# EasyEDA Pro project EPass_2026-04-09_20-28-50.eprj

# Schematic Schematic1
Board Name: Board1
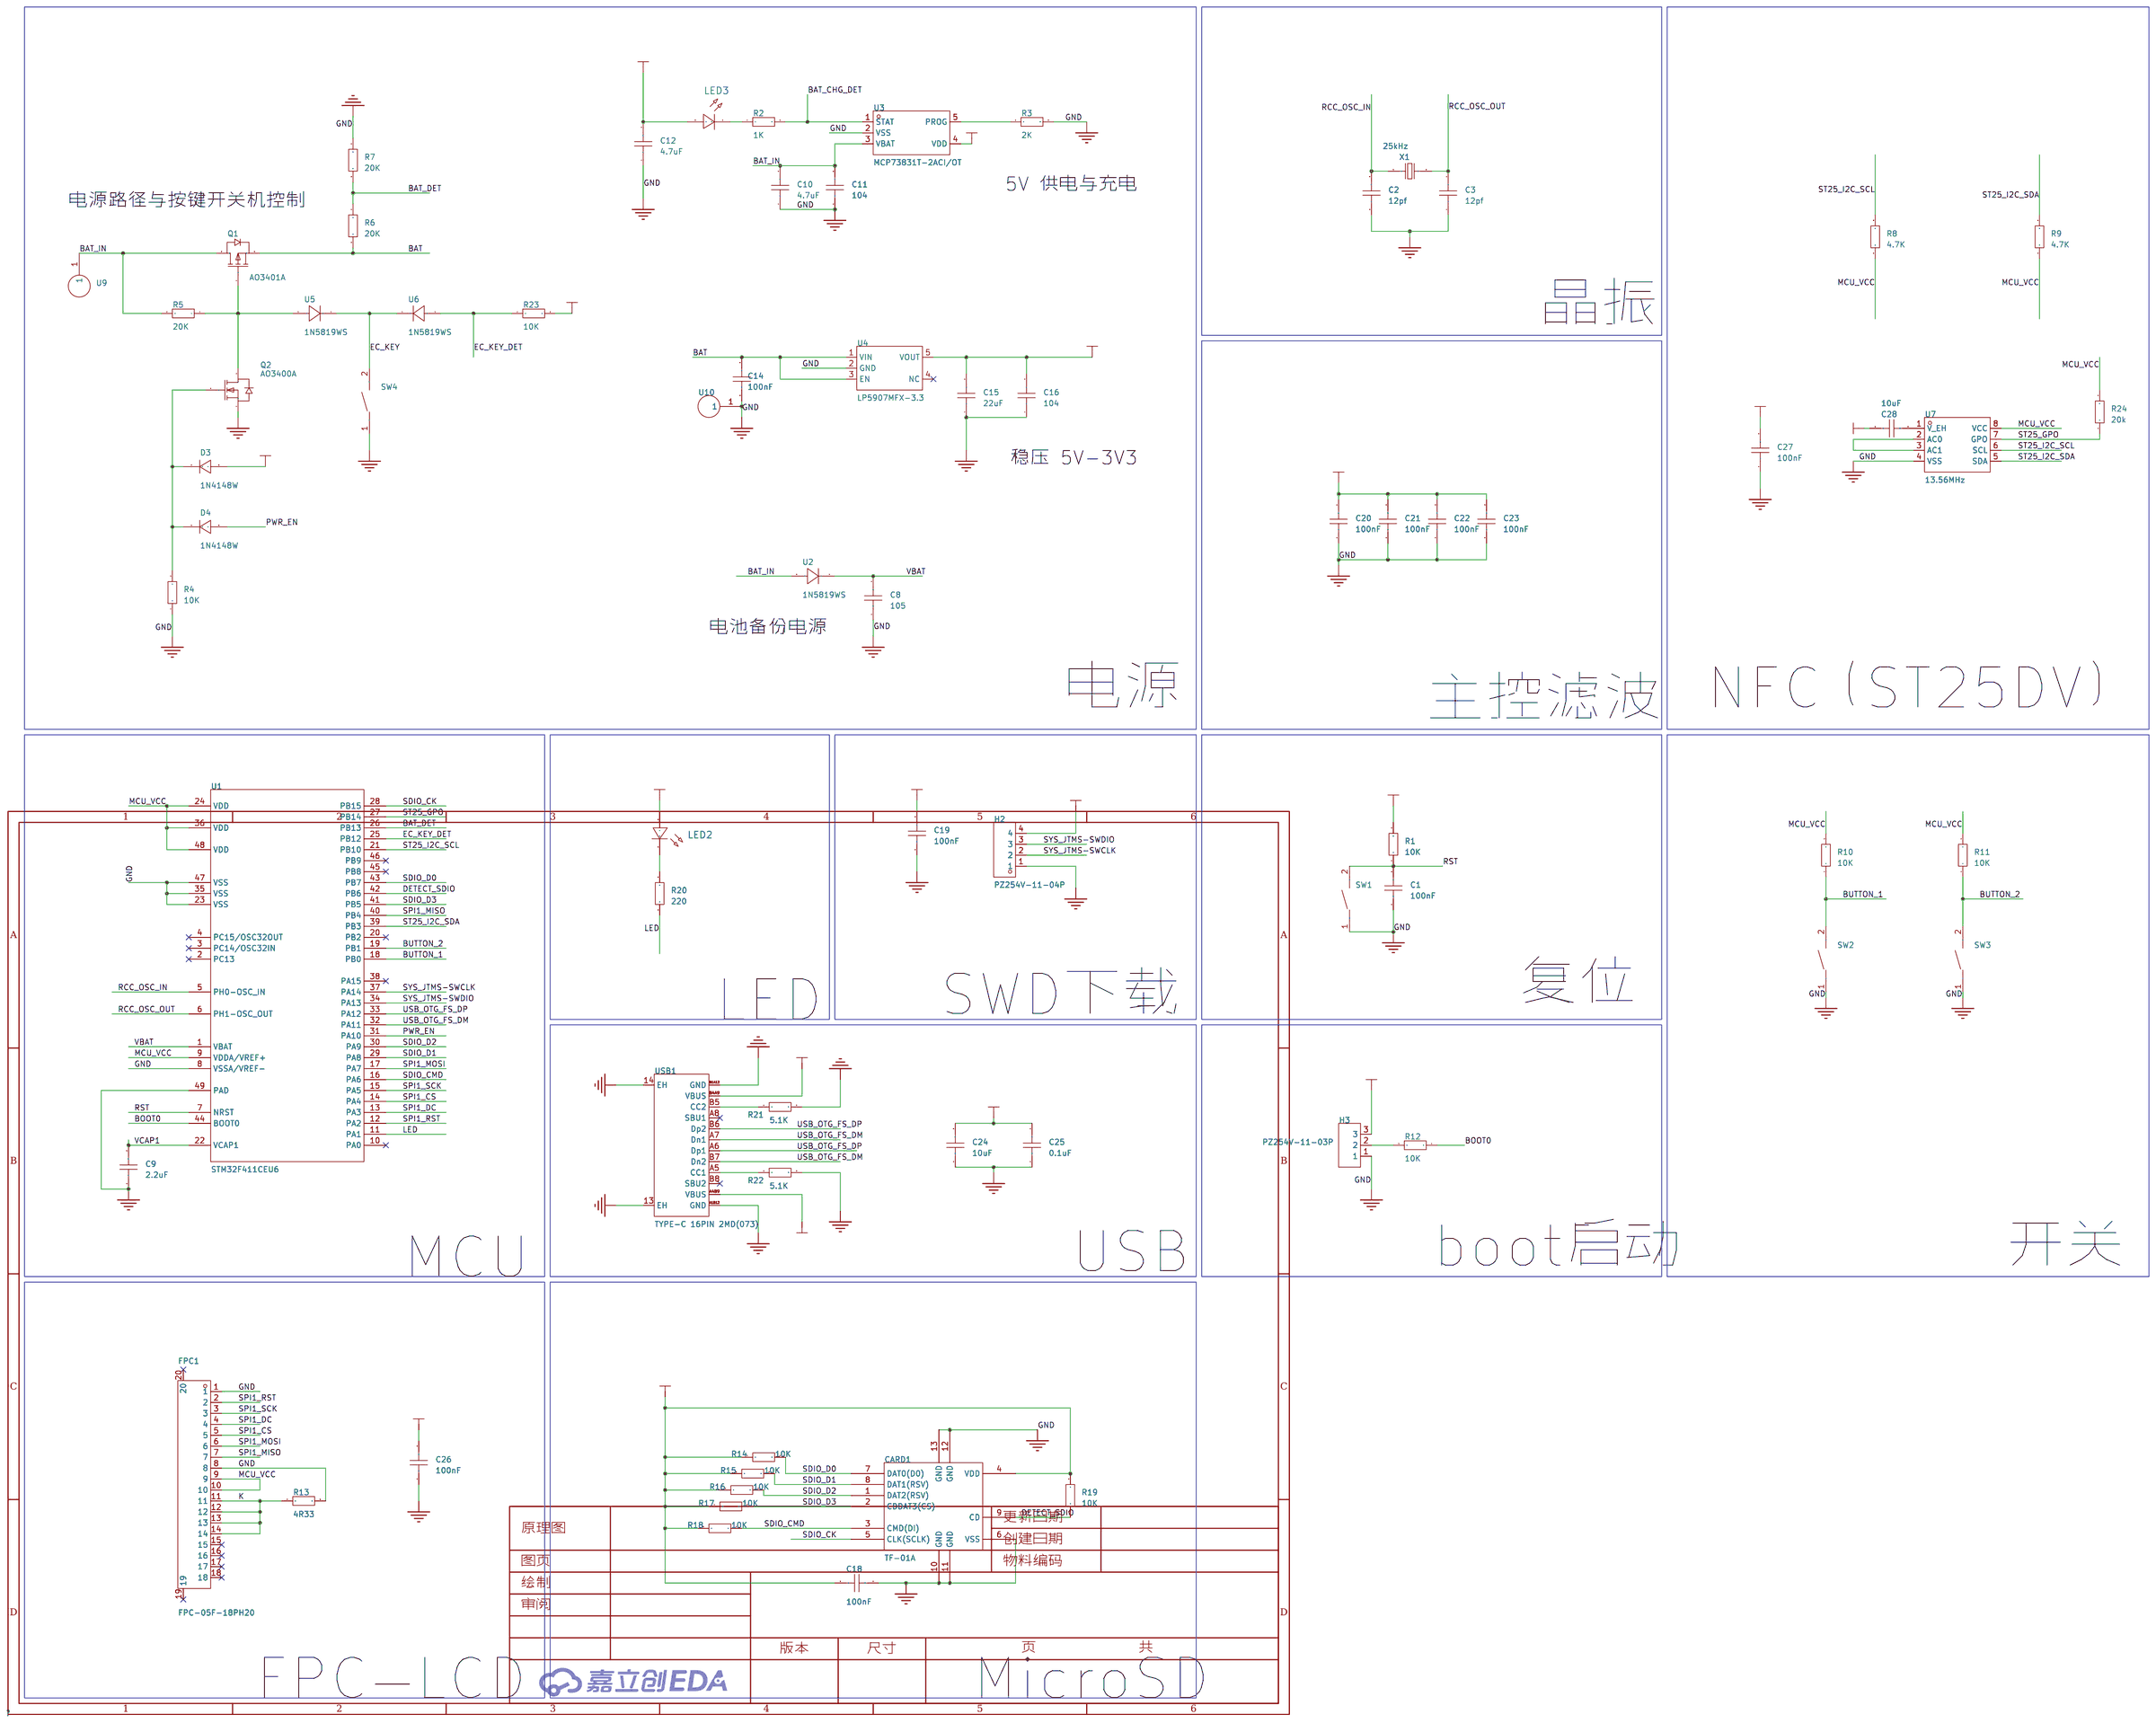
[diagram p0: schematic sheet]

## Parts
C1  100nF  [C0603]
C2  12pf  [C0603]
C3  12pf  [C0603]
C8  105  [C0603]
C9  2.2uF  [C0603]
C10  4.7uF  [C0603]
C11  104  [C0603]
C12  4.7uF  [C0603]
C14  100nF  [C0603]
C15  22uF  [C0603]
C16  104  [C0603]
C18  100nF  [C0603]
C19  100nF  [C0603]
C20  100nF  [C0603]
C21  100nF  [C0603]
C22  100nF  [C0603]
C23  100nF  [C0603]
C24  10uF  [C0603]
C25  0.1uF  [C0603]
C26  100nF  [C0603]
C27  100nF  [C0603]
C28  10uF  [C0603]
CARD1  TF-01A  [TF-SMD_TF-01A]
D3  1N4148W  [SOD-123_L2.7-W1.6-LS3.7-FD]
D4  1N4148W  [SOD-123_L2.7-W1.6-LS3.7-FD]
FPC1  FPC-05F-18PH20  [FPC-SMD_18P-P0.50_FPC-05F-18PH20]
H2  PZ254V-11-04P  [HDR-TH_4P-P2.54-V-M]
H3  PZ254V-11-03P  [HDR-TH_3P-P2.54-V-M_PZ254V-11-03P]
LED2  -  [LED_0603]
LED3  -  [LED_0603]
Q1  AO3401A  [SOT-23_L2.9-W1.3-P1.90-LS2.4-BR]
Q2  AO3400A  [SOT-23-3_L2.9-W1.3-P1.90-LS2.4-BR]
R1  10K  [R0603]
R2  1K  [R0603]
R3  2K  [R0603]
R4  10K  [R0603]
R5  20K  [R0603]
R6  20K  [R0603]
R7  20K  [R0603]
R8  4.7K  [R0603]
R9  4.7K  [R0603]
R10  10K  [R0603]
R11  10K  [R0603]
R12  10K  [R0603]
R13  4R33  [R0603]
R14  10K  [R0603]
R15  10K  [R0603]
R16  10K  [R0603]
R17  10K  [R0603]
R18  10K  [R0603]
R19  10K  [R0603]
R20  220  [R0603]
R21  5.1K  [R0603]
R22  5.1K  [R0603]
R23  10K  [R0603]
R24  20k  [R0603]
SW1  TS-1088-AR02016  [SW-SMD_L3.9-W3.0-P4.45]
SW2  TS-1088-AR02016  [SW-SMD_L3.9-W3.0-P4.45]
SW3  TS-1088-AR02016  [SW-SMD_L3.9-W3.0-P4.45]
SW4  TS-1088-AR02016  [SW-SMD_L3.9-W3.0-P4.45]
U1  STM32F411CEU6  [UFQFPN-48_L7.0-W7.0-P0.50-BL-EP]
U2  1N5819WS  [SOD-323_L1.8-W1.3-LS2.5-RD]
U3  MCP73831T-2ACI/OT  [SOT-23-5_L3.0-W1.7-P0.95-LS2.8-BL]
U4  LP5907MFX-3.3  [SOT-23-5_L3.0-W1.7-P0.95-LS2.8-BR]
U5  1N5819WS  [SOD-323_L1.8-W1.3-LS2.5-RD]
U6  1N5819WS  [SOD-323_L1.8-W1.3-LS2.5-RD]
U7  13.56MHz  [SO-8_L4.9-W3.9-P1.27-LS5.9-BL]
U9  -  [焊盘]
U10  -  [焊盘]
USB1  TYPE-C 16PIN 2MD(073)  [USB-C-SMD_TYPE-C-16PIN-2MD-073]
X1  25kHz  [FC-135R_L3.2-W1.5]

## Library data of the parts
C1-C3 C8-C12 C14-C16 C18-C28 = CAP_0603: Supplier Footprint: 0603
CARD1 = TF-01A_C91145: LCSC Part Name: 自弹式 MicroSD卡(TF卡) 卡座; Supplier Part: C91145; Manufacturer: 韩国韩荣; Supplier Footprint: SMD; JLCPCB Part Class: 扩展库; Datasheet: https://item.szlcsc.com/datasheet/TF-01A/92334.html; Supplier: LCSC; Card Connection Mode: 自弹式; Card Type: MicroSD卡(TF卡); Connector Type: 卡座; Supplementary Features: 带定位柱; Height Above Board: 1.85mm
D3 D4 = 1N4148W_C7420318: LCSC Part Name: 100V 150mA; Supplier Part: C7420318; Manufacturer: R+O(宏嘉诚); Supplier Footprint: SOD-123; JLCPCB Part Class: Extended Part; Datasheet: https://item.szlcsc.com/datasheet/1N4148W/8397140.html; Supplier: LCSC; Diode Configuration: 独立式; Pd - Power Dissipation: 400mW; Current - Rectified: 150mA; Voltage - DC Reverse(Vr): 100V; Voltage - Forward(Vf@If): 1.25V@150mA; Non-Repetitive Peak Forward Surge Current: 2A; Reverse Leakage Current (Ir): 1uA@75V; Reverse Recovery Time (trr): 4ns; Operating Junction Temperature Range: -55℃~+150℃
FPC1 = FPC-05F-18PH20: LCSC Part Name: 翻盖式 卧贴 P数:18P 间距:0.5mm; Supplier Part: C2856802; Manufacturer: XUNPU(讯普); Supplier Footprint: SMD,P=0.5mm,卧贴; JLCPCB Part Class: 扩展库; Datasheet: https://item.szlcsc.com/datasheet/FPC-05F-18PH20/3056900.html; Supplier: LCSC; Locking Feature: 翻盖式; Contact Type: 卧贴; Number of Contacts: 18P; Pitch: 0.5mm; Mounting Type: 下接; FFC, FCB Thickness: 0.3mm; Height Above Board: 2mm; Contact Material: 磷青铜; Contact Plating: 锡; Operating Temperature: -25℃~+85℃; Rated Voltage (Max): 50V; Current Rating (Max): 500mA
H2 = PZ254V-11-04P: LCSC Part Name: 1x4P 间距:2.54mm 方针 直插; Supplier Part: C2691448; Manufacturer: XFCN(兴飞); Supplier Footprint: 插件,P=2.54mm; JLCPCB Part Class: 扩展库; Datasheet: https://item.szlcsc.com/datasheet/PZ254V-11-04P/2801085.html; Supplier: LCSC; Pin Structure: 1x4P; Pitch: 2.54mm; Circluar Pins/Square Pins: 方针; Mounting Type: 直插; Number of Rows: 单排; Number of Pins: 4P; Current Rating: 3A; Voltage Rating (Max): 250V; Length of Mating Pin: 6mm; Insulation Height: 2.5mm; Length of End Connection Pin: 3mm; Operating Temperature: -40℃~+105℃; Color: 黑色
H3 = PZ254V-11-03P: LCSC Part Name: 1x3P 间距:2.54mm 方针 直插; Supplier Part: C2937625; Manufacturer: XFCN(兴飞); Supplier Footprint: 插件,P=2.54mm; JLCPCB Part Class: 扩展库; Datasheet: https://item.szlcsc.com/datasheet/PZ254V-11-03P/3293280.html; Supplier: LCSC; Pin Structure: 1x3P; Pitch: 2.54mm; Circluar Pins/Square Pins: 方针; Mounting Type: 直插; Number of Rows: 单排; Number of Pins: 3P; Current Rating: 3A; Voltage Rating (Max): 250V; Length of Mating Pin: 6mm; Insulation Height: 2.5mm; Length of End Connection Pin: 3mm; Operating Temperature: -40℃~+105℃; Color: 黑色
LED2 LED3 = LED_0603-R: Supplier Footprint: 0603
Q1 = AO3401A_C15127: LCSC Part Name: 1个P沟道 耐压:30V 电流:4A; Supplier Part: C15127; Manufacturer: AOS; Supplier Footprint: SOT-23; JLCPCB Part Class: 基础库; Datasheet: https://item.szlcsc.com/datasheet/AO3401A/15801.html; Supplier: LCSC; Number: 1个P沟道; Drain to Source Voltage: 30V; Current - Continuous Drain(Id): 4A; RDS(on): 47mΩ@10V；85mΩ@2.5V；60mΩ@4.5V; Gate Threshold Voltage (Vgs(th)): 900mV; Gate Charge(Qg): 14nC@10V; Input Capacitance(Ciss): 645pF; Reverse Transfer Capacitance (Crss@Vds): 55pF; Output Capacitance(Coss): 80pF
Q2 = AO3400A_C20917: LCSC Part Name: 1个N沟道 耐压:30V 电流:5.7A; Supplier Part: C20917; Manufacturer: AOS; Supplier Footprint: SOT-23-3L; JLCPCB Part Class: 基础库; Datasheet: https://item.szlcsc.com/datasheet/AO3400A/21629.html; Supplier: LCSC; Drain to Source Voltage: 30V; RDS(on): 48mΩ@2.5V; Gate Threshold Voltage (Vgs(th)): 1.45V@250uA; Gate Charge(Qg): 7nC@10V; Input Capacitance(Ciss): 630pF@15V; Operating Temperature: -55℃~+150℃@(Tj); Type: N沟道
R1-R24 = Res_0603: Supplier Footprint: 0603
SW1-SW4 = TS-1088-AR02016: LCSC Part Name: 4*3*2mm 立贴 轻触开关; Supplier Part: C720477; Manufacturer: XUNPU(讯普); Supplier Footprint: SMD,4x3mm; JLCPCB Part Class: 基础库; Datasheet: https://item.szlcsc.com/datasheet/TS-1088-AR02016/763484.html; Supplier: LCSC; Circuit: 单刀单掷; Actuator Style: 圆形按钮; Operating Force: 1.6N; Mounting Type: 立贴; Length: 4mm; Width: 3mm; Switch Height: 2mm; with Bracket: 不带支架; Contact Current: 50mA; Voltage Rating: 12V; Actuator/Cap Color: 黑色; Termination Style: SMD接片; Life: 10万次; Operating Temperature: -30℃~+80℃
U1 = STM32F411CEU6: LCSC Part Name: 带DSP和FPU的高性能基本型系列ARM Cortex-M4 MCU，具有512 KB Flash、100 MHz CPU和ART加速器; Supplier Part: C60420; Manufacturer: ST(意法半导体); Supplier Footprint: UFQFPN-48(7x7); JLCPCB Part Class: 扩展库; Datasheet: https://item.szlcsc.com/datasheet/STM32F411CEU6/61472.html; Supplier: LCSC; CPU Core: ARM-M4; CPU Maximum Speed: 100MHz; Program Storage Size: 512KB; Program Memory Type: FLASH; Number of I/O: 36; ADC (Bit): 12bit; Voltage - Supply: 1.7V~3.6V
U2 U5 U6 = 1N5819WS_C191023: LCSC Part Name: 电压:40V 电流:1A; Supplier Part: C191023; Manufacturer: Hottech(合科泰); Supplier Footprint: SOD-323; JLCPCB Part Class: Basic Part; Datasheet: https://item.szlcsc.com/datasheet/1N5819WS/213850.html; Supplier: LCSC; Voltage - Forward(Vf@If): 600mV@1A; Voltage - DC Reverse(Vr): 40V; Current - Rectified: 1A; Non-Repetitive Peak Forward Surge Current: 25A; Reverse Leakage Current (Ir): 500uA@40V
U3 = MCP73831T-2ACI/OT: LCSC Part Name: 单节锂离子/锂聚合物充电管理控制器; Supplier Part: C424093; Manufacturer: MICROCHIP(美国微芯); Supplier Footprint: SOT-23-5; JLCPCB Part Class: 扩展库; Datasheet: https://item.szlcsc.com/datasheet/MCP73831T-2ACI%252FOT/417116.html; Supplier: LCSC; The Chip Type: 充电芯片; Voltage - Supply: 3.75V~6V; Charge Current - Max: 550mA; Charging Saturation Voltage: 4.2V; Type of Battery: 锂电池; Number of Cells: 1; Operating Temperature: -40℃~+85℃; Battery Temperature Detection: 不支持; Supply Current (Iq): 53uA
U4 = LP5907MFX-3.3: LCSC Part Name: 集成电路; Supplier Part: C23380874; Manufacturer: TECH PUBLIC(台舟); Supplier Footprint: SOT-23-5; JLCPCB Part Class: 扩展库; Datasheet: https://item.szlcsc.com/datasheet/LP5907MFX-3.3/25111544.html; Supplier: LCSC; Output Type: 固定; Voltage - Supply: 5.5V; Output Voltage: 3.3V; Output Current: 300mA; Power Supply Rejection Ratio (PSRR): 75dB@(1kHz); Voltage Dropout: 180mV@(300mA); standby current: 2uA; Noise: 51uVrms; Features: 过流保护；带使能；过热保护; Operating Temperature: -40℃~+150℃; Output Configuration: 正极; Number of Outputs: 1
U7 = ST25DV04KC-IE6S3: LCSC Part Name: 动态NFC/RFID标签IC，带EEPROM、快速传输模式和优化I2C接口; Supplier Part: C3304276; Manufacturer: ST(意法半导体); Supplier Footprint: SO-8; JLCPCB Part Class: 扩展库; Datasheet: https://item.szlcsc.com/datasheet/ST25DV04KC-IE6S3/3868865.html; Supplier: LCSC; agreement: ISO 15693,NFC; Interface: I2C; transmission rate: 53Kbit/s; Voltage - Supply: 1.8V~5.5V
U9 U10 = 焊盘
USB1 = TYPE-C 16PIN 2MD(073): LCSC Part Name: Type-C 母 卧贴; Supplier Part: C2765186; Manufacturer: SHOU HAN(首韩); Supplier Footprint: SMD; JLCPCB Part Class: 扩展库; Datasheet: https://item.szlcsc.com/datasheet/TYPE-C%252016PIN%25202MD(073)/2901843.html; Supplier: LCSC; Connector Type: Type-C; Gender: 母; Mounting Type: 卧贴; Number of Contacts: 16P; Number of Ports: 1; Current Rating-Power: 3A; Voltage Rating: 5V; Connect-Disconnect Life: 1万次; Detection color: 黑色; Operating Temperature: -25℃~+85℃
X1 = Q13FC13500004_C32346: LCSC Part Name: 32.768kHz ±20ppm 12.5pF; Supplier Part: C32346; Manufacturer: EPSON(爱普生); Manufacturer Part: Q13FC13500004; Supplier Footprint: SMD3215-2P; JLCPCB Part Class: 基础库; Datasheet: https://item.szlcsc.com/datasheet/Q13FC13500004/33310.html; Supplier: LCSC; Type: 贴片晶振; Normal temperature Frequency Tolerance: ±20ppm; Load Capacitance: 12.5pF; Equivalent Series Resistance(ESR): 70kΩ; Operating Temperature: -40℃~+85℃

## Nets
+5V: C12.2 C24.2 C25.2 D3.2(A) LED3.2(A) U3.4(VDD) USB1.A4B9(VBUS) USB1.B4A9(VBUS)
GND: C1.1 C2.1 C3.1 C8.1 C9.1 C10.1 C11.1 C12.1 C14.1 C15.1 C16.1 C18.2 C19.1 C20.1 C21.1 C22.1 C23.1 C24.1 C25.1 C26.1 C27.1 CARD1.6(VSS) CARD1.10(GND) CARD1.11(GND) CARD1.12(GND) CARD1.13(GND) FPC1.1 FPC1.8 H2.1 H3.1 Q2.2(S) R3.2 R4.1 R7.1 R13.2 R21.2 R22.2 SW1.1 SW2.1 SW3.1 SW4.1 U1.8(VSSA/VREF-) U1.23(VSS) U1.35(VSS) U1.47(VSS) U1.49(PAD) U3.2(VSS) U4.2(GND) U7.4(VSS) U10.1 USB1.13(EH) USB1.14(EH) USB1.A1B12(GND) USB1.B1A12(GND)
VBAT: C8.2 U1.1(VBAT) U2.1(K)
BAT: C14.2 Q1.2(S) R6.2 U4.1(VIN) U4.3(EN)
BAT_CHG_DET: R2.2 U3.1(STAT)
BAT_DET: R6.1 R7.2 U1.26(PB13)
BAT_IN: C10.2 C11.2 Q1.3(D) R5.2 U2.2(A) U3.3(VBAT) U9.1
BOOT0: R12.1 U1.44(BOOT0)
BUTTON_1: R10.1 SW2.2 U1.18(PB0)
BUTTON_2: R11.1 SW3.2 U1.19(PB1)
DETECT_SDIO: CARD1.9(CD) R19.1 U1.42(PB6)
EC_KEY: SW4.2 U5.1(K) U6.1(K)
EC_KEY_DET: R23.1 U1.25(PB12) U6.2(A)
K: FPC1.11 FPC1.12 FPC1.13 FPC1.14 R13.1
LED: R20.1 U1.11(PA1)
MCU_VCC: C15.2 C16.2 C18.1 C19.2 C20.2 C21.2 C22.2 C23.2 C26.2 C27.2 C28.2 CARD1.4(VDD) FPC1.9 FPC1.10 H2.4 H3.3 LED2.2(A) R1.2 R8.1 R9.1 R10.2 R11.2 R14.1 R15.1 R16.1 R17.1 R18.1 R19.2 R23.2 R24.2 U1.9(VDDA/VREF+) U1.24(VDD) U1.36(VDD) U1.48(VDD) U4.5(VOUT) U7.8(VCC)
PWR_EN: D4.2(A) U1.31(PA10)
RCC_OSC_IN: C2.2 U1.5(PH0-OSC_IN) X1.1
RCC_OSC_OUT: C3.2 U1.6(PH1-OSC_OUT) X1.2
RST: C1.2 R1.1 SW1.2 U1.7(NRST)
SDIO_CK: CARD1.5(CLK(SCLK)) U1.28(PB15)
SDIO_CMD: CARD1.3(CMD(DI)) R18.2 U1.16(PA6)
SDIO_D0: CARD1.7(DAT0(D0)) R14.2 U1.43(PB7)
SDIO_D1: CARD1.8(DAT1(RSV)) R15.2 U1.29(PA8)
SDIO_D2: CARD1.1(DAT2(RSV)) R16.2 U1.30(PA9)
SDIO_D3: CARD1.2(CDDAT3(CS)) R17.2 U1.41(PB5)
SPI1_CS: FPC1.5 U1.14(PA4)
SPI1_DC: FPC1.4 U1.13(PA3)
SPI1_MISO: FPC1.7 U1.40(PB4)
SPI1_MOSI: FPC1.6 U1.17(PA7)
SPI1_RST: FPC1.2 U1.12(PA2)
SPI1_SCK: FPC1.3 U1.15(PA5)
ST25_GPO: R24.1 U1.27(PB14) U7.7(GPO)
ST25_I2C_SCL: R8.2 U1.21(PB10) U7.6(SCL)
ST25_I2C_SDA: R9.2 U1.39(PB3) U7.5(SDA)
SYS_JTMS-SWCLK: H2.2 U1.37(PA14)
SYS_JTMS-SWDIO: H2.3 U1.34(PA13)
USB_OTG_FS_DM: U1.32(PA11) USB1.A7(Dn1) USB1.B7(Dn2)
USB_OTG_FS_DP: U1.33(PA12) USB1.A6(Dp1) USB1.B6(Dp2)
VCAP1: C9.2 U1.22(VCAP1)
$1N3013: LED3.1(C) R2.1
$1N3017: R3.1 U3.5(PROG)
$1N3940: D3.1(C) D4.1(C) Q2.1(G) R4.2
$1N4134: Q1.1(G) Q2.3(D) R5.1 U5.2(A)
$1N5541: U7.2(AC0) U7.3(AC1)
$1N11724: LED2.1(C) R20.2
$1N12366: R21.1 USB1.B5(CC2)
$1N12483: R22.1 USB1.A5(CC1)
$1N12902: H3.2 R12.2
$1N28171: C28.1 U7.1(V_EH)

Not connected (* = marked no-connect by the designer): FPC1 15* 16* 17* 18* 19* 20*; U1 2(PC13)* 3(PC14/OSC32IN)* 4(PC15/OSC32OUT)* 10(PA0)* 20(PB2)* 38(PA15)* 45(PB8)* 46(PB9)*; U4 4(NC)*; USB1 A8(SBU1)* B8(SBU2)*

## Notes on the sheet
- 5V 供电与充电
- 电源路径与按键开关机控制
- 晶振
- 稳压 5V-3V3
- 电池备份电源
- 电源
- 主控滤波
- NFC（ST25DV）
- 复位
- SWD下载
- LED
- USB
- boot启动
- 开关
- MCU
- FPC—LCD
- MicroSD

# Board PCB1
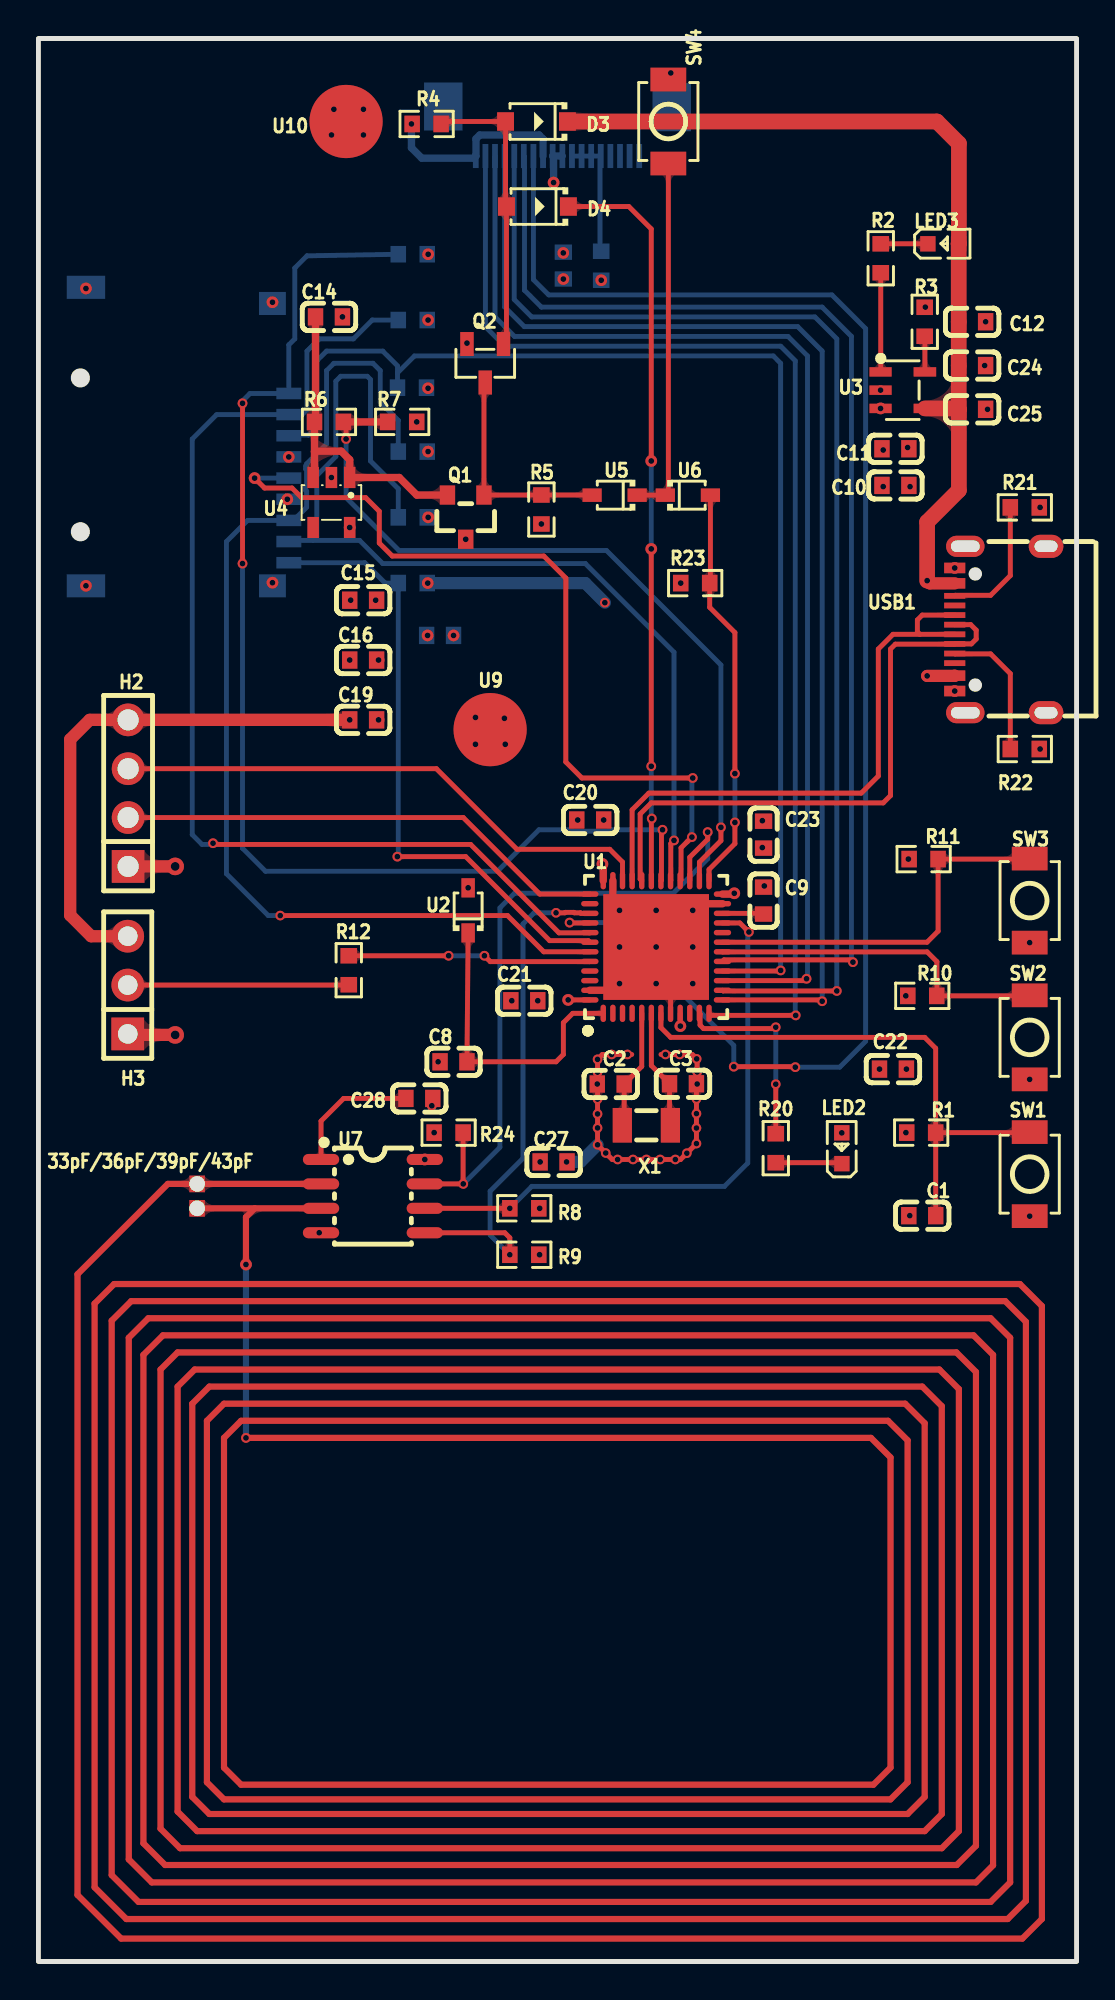
[diagram p1: board, top side]
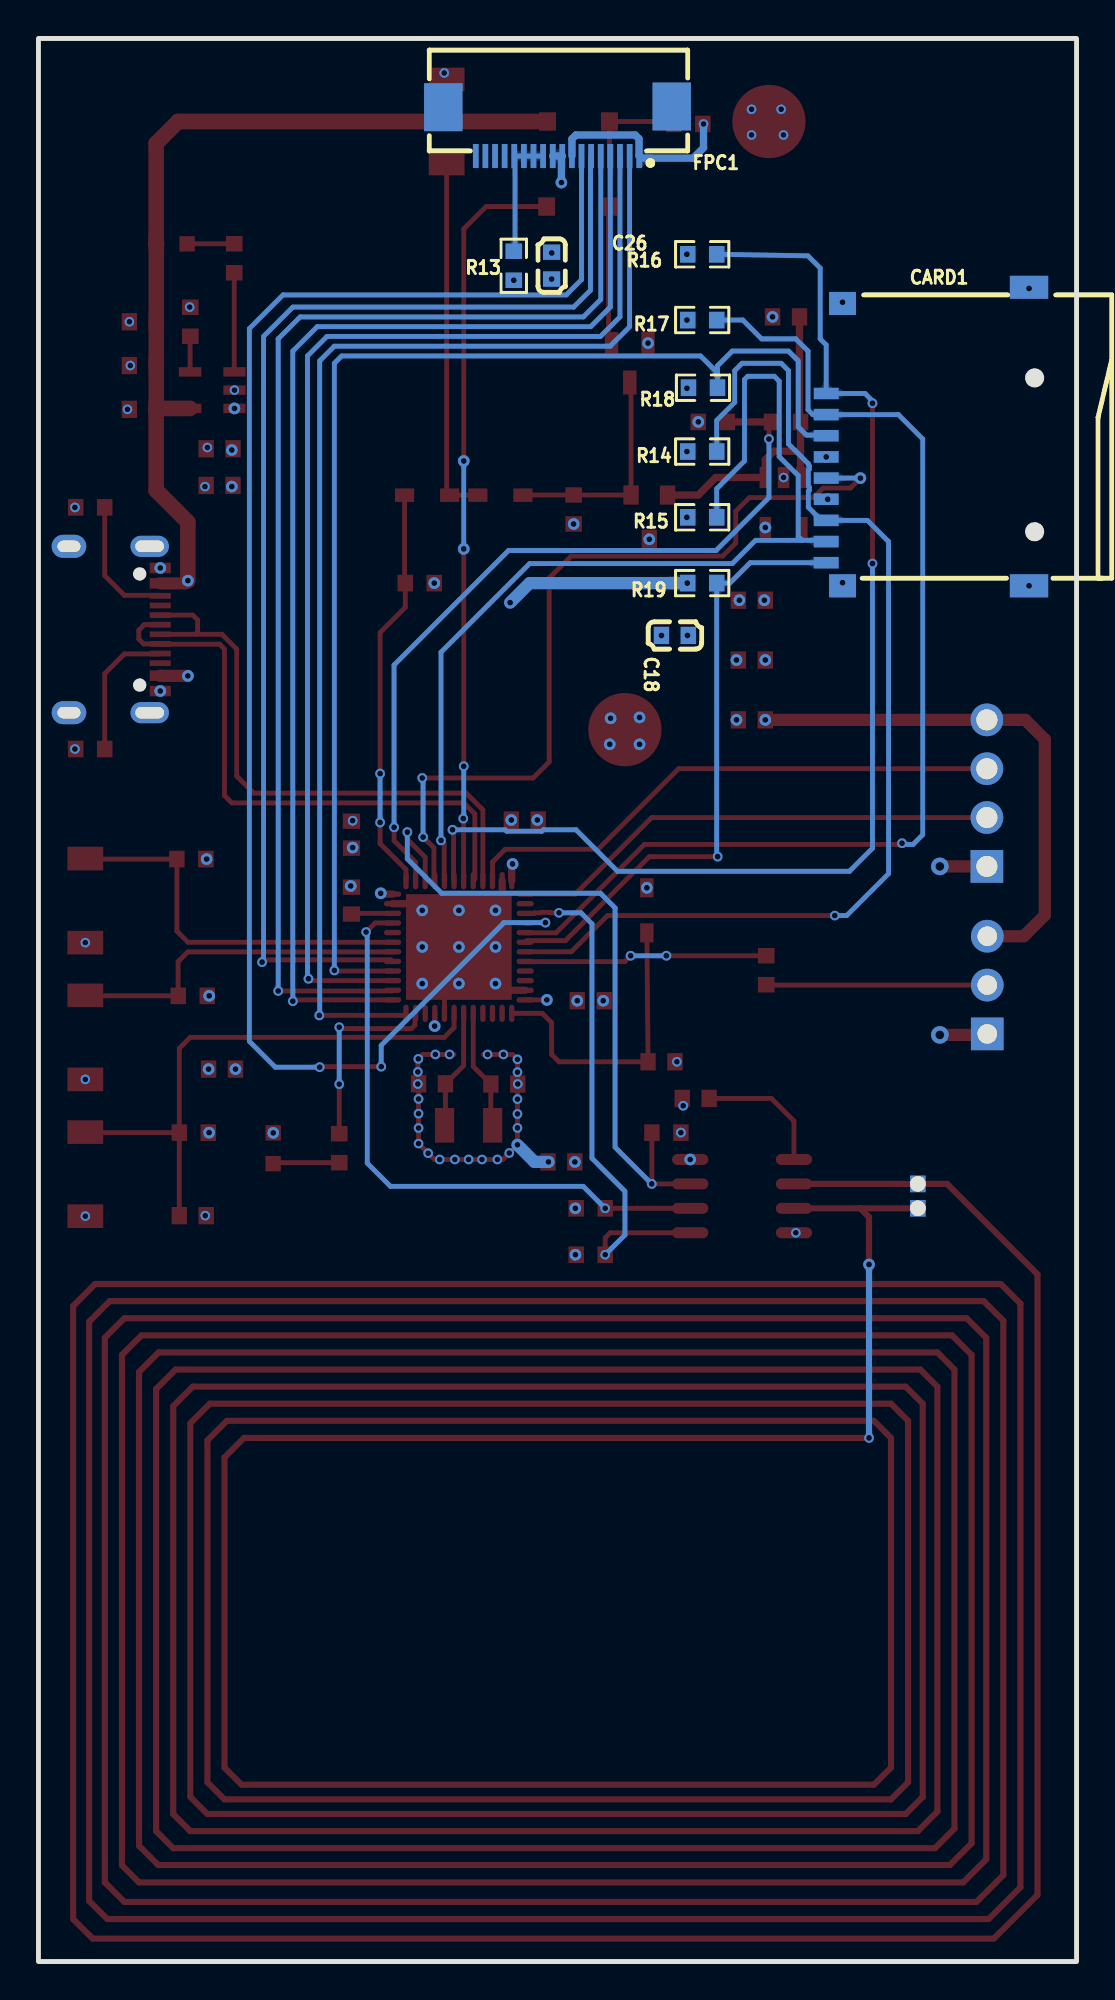
[diagram p2: board, bottom side, seen from below]

Outline 54 x 100 mm; copper layers: Top Layer, POW, GND, Bottom Layer. Coordinates in mm from the lower left corner of the outline.
Outline path: rectangle 0,100 54,0
Stack: Top Layer 0.035mm 外层铜厚1oz / Dielectric1 0.2104mm 7628 RC49% 8.6mil / POW 0.0152mm 内层铜厚 / Dielectric2 1.065mm 1.1mm H/HOZ Copper / GND 0.0152mm 内层铜厚 / Dielectric3 0.2104mm 7628 RC49% 8.6mil / Bottom Layer 0.035mm 外层铜厚1oz

## Design rules (mm)
net RCC_OSC_IN: DP2
net RCC_OSC_OUT: DP2
net USB_OTG_FS_DM: DP1
net USB_OTG_FS_DP: DP1
template: 自定义配置
spacing copperThickness1oz (default): track to track 0.102, other pairs 0.152 to 0.3
spacing copperThickness2oz: track to track 0.203, other pairs 0.152 to 0.3
track width copperThickness1oz (default): min 0.127, default 0.254, max 2.54
track width copperThickness2oz: min 0.203, default 0.254, max 2.54
differential pair differentialPair (default): width min 0.127, default 0.254, max 2.54; gap min 0.152, default 0.152
via viaSize (default): diameter min 0.5, default 0.61, max 10; hole min 0.3, default 0.305, max 6.3

## Placement (name value [footprint] x y rotation side)
C1  100nF  [C0603]  45.97 38.79 0 top
C2  12pf  [C0603]  29.77 45.63 0 top
C3  12pf  [C0603]  33.53 45.64 180 top
C8  105  [C0603]  21.59 46.79 0 top
C9  2.2uF  [C0603]  37.72 55.17 270 top
C10  4.7uF  [C0603]  44.58 76.76 180 top
C11  104  [C0603]  44.58 78.66 180 top
C12  4.7uF  [C0603]  48.57 85.27 180 top
C14  100nF  [C0603]  15.11 85.52 180 top
C15  22uF  [C0603]  16.89 70.79 180 top
C16  104  [C0603]  16.89 67.68 180 top
C18  100nF  [C0603]  20.89 68.96 0 bottom
C19  100nF  [C0603]  16.89 64.57 180 top
C20  100nF  [C0603]  28.7 59.36 0 top
C21  100nF  [C0603]  25.27 49.96 0 top
C22  100nF  [C0603]  44.45 46.41 180 top
C23  100nF  [C0603]  37.72 58.6 270 top
C24  10uF  [C0603]  48.57 82.99 180 top
C25  0.1uF  [C0603]  48.57 80.72 180 top
C26  100nF  [C0603]  27.31 88.19 90 bottom
C27  100nF  [C0603]  26.8 41.58 180 top
C28  10uF  [C0603]  19.81 44.88 0 top
CARD1  TF-01A  [TF-SMD_TF-01A]  7.75 79.3 90 bottom
D3  1N4148W  [SOD-123_L2.7-W1.6-LS3.7-FD]  25.91 95.68 0 top
D4  1N4148W  [SOD-123_L2.7-W1.6-LS3.7-FD]  25.96 91.26 0 top
FPC1  FPC-05F-18PH20  [FPC-SMD_18P-P0.50_FPC-05F-18PH20]  27 95.17 0 bottom
H2  PZ254V-11-04P  [HDR-TH_4P-P2.54-V-M]  4.66 60.76 90 top
H3  PZ254V-11-03P  [HDR-TH_3P-P2.54-V-M_PZ254V-11-03P]  4.64 50.78 90 top
LED2  -  [LED_0603]  41.78 42.34 90 top
LED3  -  [LED_0603]  47.12 89.33 0 top
NOREF  -  [Pad_e929]  8.25 39.17 0 top
NOREF#2  -  [Pad_e926]  8.25 40.44 0 top
Q1  AO3401A  [SOT-23_L2.9-W1.3-P1.90-LS2.4-BR]  22.22 75.11 90 top
Q2  AO3400A  [SOT-23-3_L2.9-W1.3-P1.90-LS2.4-BR]  23.24 83.11 90 top
R1  10K  [R0603]  45.92 43.1 180 top
R2  1K  [R0603]  43.81 88.57 270 top
R3  2K  [R0603]  46.1 85.27 90 top
R4  10K  [R0603]  20.19 95.56 0 top
R5  20K  [R0603]  26.16 75.51 270 top
R6  20K  [R0603]  15.11 80.06 180 top
R7  20K  [R0603]  18.92 80.06 180 top
R8  4.7K  [R0603]  25.27 39.17 180 top
R9  4.7K  [R0603]  25.27 36.75 180 top
R10  10K  [R0603]  45.97 50.22 180 top
R11  10K  [R0603]  46.05 57.33 180 top
R12  10K  [R0603]  16.14 51.55 270 top
R13  4R33  [R0603]  29.28 88.18 270 bottom
R14  10K  [R0603]  19.47 78.52 180 bottom
R15  10K  [R0603]  19.47 75.1 180 bottom
R16  10K  [R0603]  19.47 88.78 180 bottom
R17  10K  [R0603]  19.47 85.36 180 bottom
R18  10K  [R0603]  19.43 81.84 180 bottom
R19  10K  [R0603]  19.47 71.68 0 bottom
R20  220  [R0603]  38.35 42.29 270 top
R21  5.1K  [R0603]  51.31 75.62 0 top
R22  5.1K  [R0603]  51.31 63.05 0 top
R23  10K  [R0603]  34.16 71.68 180 top
R24  20k  [R0603]  21.34 43.1 180 top
SW1  TS-1088-AR02016  [SW-SMD_L3.9-W3.0-P4.45]  51.56 40.94 90 top
SW2  TS-1088-AR02016  [SW-SMD_L3.9-W3.0-P4.45]  51.56 48.06 90 top
SW3  TS-1088-AR02016  [SW-SMD_L3.9-W3.0-P4.45]  51.56 55.17 90 top
SW4  TS-1088-AR02016  [SW-SMD_L3.9-W3.0-P4.45]  32.77 95.68 270 top
U1  STM32F411CEU6  [UFQFPN-48_L7.0-W7.0-P0.50-BL-EP]  32.13 52.76 0 top
U2  1N5819WS  [SOD-323_L1.8-W1.3-LS2.5-RD]  22.35 54.66 90 top
U3  MCP73831T-2ACI/OT  [SOT-23-5_L3.0-W1.7-P0.95-LS2.8-BL]  44.96 81.71 270 top
U4  LP5907MFX-3.3  [SOT-23-5_L3.0-W1.7-P0.95-LS2.8-BR]  15.24 75.87 90 top
U5  1N5819WS  [SOD-323_L1.8-W1.3-LS2.5-RD]  29.97 76.25 180 top
U6  1N5819WS  [SOD-323_L1.8-W1.3-LS2.5-RD]  33.78 76.25 0 top
U7  13.56MHz  [SO-8_L4.9-W3.9-P1.27-LS5.9-BL]  17.4 39.8 270 top
U9  -  [焊盘]  23.5 64.06 270 top
U10  -  [焊盘]  16 95.68 0 top
USB1  TYPE-C 16PIN 2MD(073)  [USB-C-SMD_TYPE-C-16PIN-2MD-073]  50.04 69.27 90 top
X1  25kHz  [FC-135R_L3.2-W1.5]  31.62 43.48 0 top

## Footprints (pads in the part's own frame, mm; a bottom-side part is the same pattern mirrored in y, then rotated)
C0603
  rect 0.8x0.9 smd: 1(-0.7,0) 2(0.7,0)
FC-135R_L3.2-W1.5
  rect 1x1.8 smd: 1(-1.25,0) 2(1.25,0)
FPC-SMD_18P-P0.50_FPC-05F-18PH20
  rect 0.3x1.25 smd: 1(-4.25,1.288) 2(-3.75,1.288) 3(-3.25,1.288) 4(-2.75,1.288) 5(-2.25,1.288) 6(-1.75,1.288) 7(-1.25,1.288) 8(-0.75,1.288) 9(-0.25,1.288) 10(0.25,1.288) 11(0.75,1.288) 12(1.25,1.288) 13(1.75,1.288) 14(2.25,1.288) 15(2.75,1.288) 16(3.25,1.288) 17(3.75,1.288) 18(4.25,1.288)
  rect 2x2.5 smd: 19(-5.94,-1.288) 20(5.94,-1.252)
HDR-TH_3P-P2.54-V-M_PZ254V-11-03P
  rect 1.7x1.7 hole 1.02: 1(-2.54,0)
  round 1.7 hole 1.02: 2(0,0) 3(2.54,0)
HDR-TH_4P-P2.54-V-M
  rect 1.7x1.7 hole 1.1: 1(-3.81,0)
  round 1.7 hole 1.1: 2(-1.27,0) 3(1.27,0) 4(3.81,0)
LED_0603
  rect 0.8x0.8 smd: 1(-0.851,-0.01) 2(0.75,-0.005)
Pad_e926
  rect 0.806x0.864 hole 0.914: 1(0,0)
Pad_e929
  rect 0.806x0.864 hole 0.914: 1(0,0)
R0603
  rect 0.806x0.864 smd: 1(-0.753,0) 2(0.753,0)
SO-8_L4.9-W3.9-P1.27-LS5.9-BL
  oval 0.574x1.888 smd: 1(-1.905,-2.699) 2(-0.635,-2.699) 3(0.635,-2.699) 4(1.905,-2.699) 5(1.905,2.699) 6(0.635,2.699) 7(-0.635,2.699) 8(-1.905,2.699)
SOD-123_L2.7-W1.6-LS3.7-FD
  rect 0.88x0.96 smd: 1(-1.61,0) 2(1.61,0)
SOD-323_L1.8-W1.3-LS2.5-RD
  rect 1x0.7 smd: 1(-1.173,0) 2(1.173,0)
SOT-23-3_L2.9-W1.3-P1.90-LS2.4-BR
  rect 1.25x0.7 smd: 1(1,-0.95) 2(1,0.95) 3(-1,0)
SOT-23-5_L3.0-W1.7-P0.95-LS2.8-BL
  rect 0.49x1.157 smd: 1(-0.95,-1.153) 2(0,-1.153) 3(0.95,-1.153)
  rect 0.49x1.175 smd: 4(0.95,1.153) 5(-0.95,1.153)
SOT-23-5_L3.0-W1.7-P0.95-LS2.8-BR
  rect 1.1x0.6 smd: 1(1.3,-0.95) 2(1.3,0) 3(1.3,0.95) 4(-1.3,0.95) 5(-1.3,-0.95)
SOT-23_L2.9-W1.3-P1.90-LS2.4-BR
  rect 1x0.8 smd: 1(1.15,-0.95) 2(1.15,0.95) 3(-1.15,0)
SW-SMD_L3.9-W3.0-P4.45
  rect 1.23x1.86 smd: 1(-2.185,0) 2(2.185,0)
TF-SMD_TF-01A
  rect 0.6x1.3 smd: 1(2.24,5.276) 2(1.14,5.276) 3(0.04,5.276) 4(-1.06,5.276) 5(-2.16,5.276) 6(-3.26,5.276) 7(-4.36,5.276) 8(-5.46,5.276) 9(-6.56,5.276)
  rect 1.2x1.4 smd: 10(-7.76,4.426) 13(6.92,4.426)
  rect 1.2x2 smd: 11(-7.76,-5.276) 12(7.76,-5.276)
UFQFPN-48_L7.0-W7.0-P0.50-BL-EP
  oval 0.28x0.9 smd: 1(-2.751,-3.45) 2(-2.251,-3.45) 3(-1.75,-3.45) 4(-1.25,-3.45) 5(-0.749,-3.45) 6(-0.249,-3.45) 7(0.249,-3.45) 8(0.75,-3.45) 9(1.25,-3.45) 10(1.75,-3.45) 11(2.251,-3.45) 12(2.751,-3.45) 25(2.751,3.449) 26(2.251,3.449) 27(1.75,3.449) 28(1.25,3.449) 29(0.75,3.449) 30(0.249,3.449) 31(-0.249,3.449) 32(-0.749,3.449) 33(-1.25,3.449) 34(-1.75,3.449) 35(-2.251,3.449) 36(-2.751,3.449)
  oval 0.9x0.28 smd: 13(3.45,-2.751) 14(3.45,-2.251) 15(3.45,-1.75) 16(3.45,-1.25) 17(3.45,-0.75) 18(3.45,-0.249) 19(3.45,0.249) 20(3.45,0.749) 21(3.45,1.25) 22(3.45,1.75) 23(3.45,2.251) 24(3.45,2.751) 37(-3.449,2.751) 38(-3.449,2.251) 39(-3.449,1.75) 40(-3.449,1.25) 41(-3.449,0.749) 42(-3.449,0.249) 43(-3.449,-0.249) 44(-3.449,-0.75) 45(-3.449,-1.25) 46(-3.449,-1.75) 47(-3.449,-2.251) 48(-3.449,-2.751)
  rect 5.5x5.5 smd: 49(0,0)
USB-C-SMD_TYPE-C-16PIN-2MD-073
  oval 1.1x2 hole 0.6x1.5: 13(-4.325,1.825) 14(4.325,1.825)
  oval 1.2x1.8 hole 0.6x1.2: 13(-4.325,-2.375) 14(4.325,-2.375)
  rect 0.55x1.1 smd: A1B12(-3.2,2.375) A4B9(-2.4,2.375) B1A12(3.2,2.375) B4A9(2.4,2.375)
  rect 0.3x1.1 smd: A5(-1.25,2.375) A6(-0.25,2.375) A7(0.25,2.375) A8(1.25,2.375) B5(1.75,2.375) B6(0.75,2.375) B7(-0.75,2.375) B8(-1.75,2.375)
焊盘
  round 3.81 smd: 1(0,0)

## Nets
As in the schematic, except:
$1N5541: NOREF.1 NOREF#2.1 U7.2 U7.3

Pads without a net: FPC1 15 16 17 18 19 20; U1 2 3 4 10 20 38 45 46; U4 4; USB1 A8 B8

## Via types
v1: diameter 0.5, hole 0.3, Top Layer to Bottom Layer, 53 vias
v2: diameter 0.61, hole 0.305, Top Layer to Bottom Layer, 76 vias
v3: diameter 0.914, hole 0.457, Top Layer to Bottom Layer, 2 vias
v4: diameter 0.508, hole 0.305, Top Layer to Bottom Layer, 34 vias

## Routing (per net, layer and track width the routed paths; a pad name or vN(x,y) marks a point on that pad's centre or on a via; arc(x,y) is an arc through that point)
+5V: length 49
  Top Layer w0.635: v2(46.23,66.85) 47.65,66.85 USB1.A4B9 ; v2(46.23,71.81) 46.37,71.67 USB1.B4A9
  Top Layer w0.813: C25.2 C24.2 C12.2 47.87,89.32 LED3.2 47.88,89.34 47.88,94.54 46.74,95.68 D3.2 ; C25.2 47.88,80.71 47.88,76.5 46.23,74.85 v2(46.23,71.81) ; C25.2 47.82,80.76 U3.4
GND: length 52.6
  Top Layer w0.254: 32.38,47.17 v1(33.35,47.17) 34.01,47.17 v1(34.24,46.94) 34.26,46.91 v1(34.26,46.26) v1(34.26,45.63) ; U1.8 32.88,52.01 v2(32.13,52.76) ; 30.86,47.17 v1(29.82,47.17) 29.34,47.17 v1(29.08,46.91) v1(29.08,46.25) 29.08,45.64 v1(29.07,45.63) 29.08,45.62 v1(29.08,44.84) v1(29.08,44.08) v1(29.08,43.35) v1(29.08,42.47) v1(29.51,42.04) 29.84,41.71 v1(30.13,41.71) v1(30.93,41.71) v1(31.62,41.71) v1(32.34,41.71) v1(33.13,41.71) 33.4,41.71 v1(33.73,42.03) v1(34.23,42.53) v1(34.23,43.34) v1(34.23,44.09) v1(34.23,44.86) C3.1
  Top Layer w0.381: U1.47 29.88,50.51 v2(32.13,52.76) ; v2(32.13,52.76) v2(30.23,54.66) 29.88,55.01 U1.35 ; v2(32.13,52.76) v2(34.04,54.66) 34.38,55.01 U1.23
  Top Layer w0.635: v3(7.11,56.95) H2.1 ; H3.1 4.7,48.18 v3(7.11,48.18)
  Bottom Layer w0.381: v1(19.4,95.56) 19.4,94.31 19.94,93.78 22.64,93.78 FPC1.1 22.76,93.89 22.76,94.78 22.96,94.98 26.04,94.98 26.25,94.77 FPC1.8
  Bottom Layer w0.635: v1(27.47,41.58) 28.19,41.58 v1(29.08,42.47)
  vias: v1(14.6,37.9) v1(15.24,94.98) v1(15.24,77.17) v1(15.37,96.32) v1(16.91,96.32) v1(16.91,94.98) v1(20.79,46.79) v1(30.64,47.17) v1(32.62,47.17) v1(32.89,98.21) v1(43.8,81.71) v1(45.21,78.73) v1(45.34,76.69) v1(45.32,38.79) v1(46.13,86.03) v1(49.22,82.99) v1(49.27,85.27) v1(49.37,80.72) v1(51.56,52.98) v1(51.56,45.87) v1(51.56,38.76) v2(2.47,87) v2(2.47,71.54) v2(12.17,86.28) v2(12.17,71.7) v2(12.95,76.04) v2(15.81,85.52) v2(17.54,70.79) v2(17.69,67.68) v2(17.69,64.57) v2(19.68,80.06) v2(21.59,68.96) v2(22.29,84.16) v2(24.62,49.96) v2(27.31,87.49) v2(28.05,59.36) v2(29.28,87.43) v2(30.23,52.76) v2(30.23,50.85) v2(32.13,54.66) v2(32.13,50.85) v2(34.04,52.76) v2(34.04,50.85) v2(37.76,55.93) v2(45.15,46.41) v2(47.66,72.47) v2(47.66,66.07) v4(37.66,59.32) v4(52.1,75.62) v4(52.1,63.05)
VBAT: length 15.8
  Top Layer w0.254: U1.1 27.79,49.31 27.31,48.82 27.31,47.17 26.92,46.79 C8.2 U2.1
BAT: length 16.8
  Top Layer w0.381: 14.36,78.52 14.36,77.24 U4.3 ; 14.36,78.52 14.38,78.54 15.75,78.54 16.19,78.09 U4.1 18.77,77.17 19.68,76.26 Q1.2 ; 14.36,78.52 R6.2 14.41,80.11 C14.2
BAT_CHG_DET: length 5.2
  Top Layer w0.254: U3.1 43.81,82.67 R2.2
BAT_DET: length 41.1
  Top Layer w0.254: 15.87,80.06 16,79.93 v4(16,79.17) ; v4(35.5,58.98) 35.5,58.28 34.38,57.17 U1.26
  Top Layer w0.381: R6.1 18.17,80.06
  Bottom Layer w0.254: v4(16,79.17) 16,76.12 18.75,73.37 29.55,73.37 35.5,67.42 v4(35.5,58.98)
BAT_IN:
  vias: v2(22.22,73.96) v2(22.35,55.83) v2(22.73,64.69) v2(22.73,63.3) v2(24.24,64.65) v2(24.28,63.3) v2(26.16,74.75) v2(43.8,80.76) v2(43.94,78.6) v2(43.94,76.7)
BOOT0: length 12.7
  Top Layer w0.254: v4(23.2,52.3) 23.5,51.99 28.67,51.99 U1.44 ; 16.14,52.3 v4(21.34,52.3)
  Bottom Layer w0.254: v4(23.2,52.3) v4(21.34,52.3)
BUTTON_1: length 18
  Top Layer w0.254: U1.18 35.59,52.5 46.23,52.5 46.74,51.99 46.74,50.22 R10.1 51.54,50.22 SW2.2
BUTTON_2: length 20
  Top Layer w0.254: U1.19 46.22,53 46.8,53.58 46.8,57.33 51.54,57.33 SW3.2
DETECT_SDIO: length 32.2
  Top Layer w0.254: U1.42 28.6,53.09 26.59,53.09 22.22,57.45 v4(18.67,57.45)
  Bottom Layer w0.254: CARD1.9 16.97,72.74 18.03,71.68 R19.1 18.72,57.5 v4(18.67,57.45)
EC_KEY: length 18.8
  Top Layer w0.254: U5.1 U6.1 32.77,76.41 SW4.2
EC_KEY_DET: length 21.2
  Top Layer w0.254: U6.2 34.95,71.72 R23.1 34.92,70.42 36.23,69.11 v4(36.23,61.77) ; U1.25 34.88,56.78 36.23,58.13 v4(36.23,59.23)
  Bottom Layer w0.254: v4(36.23,59.23) v4(36.23,61.77)
K: length 6.5
  Bottom Layer w0.254: FPC1.11 FPC1.12 FPC1.13 FPC1.14 29.21,93.85 29.21,89 R13.1
LED: length 10.2
  Top Layer w0.254: U1.11 34.42,49.27 34.42,48.69 34.6,48.51 38.28,48.51 v1(38.35,48.59) ; R20.1 v1(38.35,45.62)
  Bottom Layer w0.254: v1(38.35,45.62) v1(38.35,48.59)
MCU_VCC: length 42.5
  Top Layer w0.254: v2(27.55,50) U1.48 ; 33.4,48.56 33.4,48.63 v2(33.39,48.64) 33.38,48.65 U1.9
  Top Layer w0.381: v2(36.19,55.55) 36.15,55.51 U1.24 ; v2(29.34,57.07) 29.38,57.03 U1.36
  Top Layer w0.635: H3.3 2.74,53.32 1.65,54.41 1.65,63.55 2.67,64.57 H2.4 v2(16.19,64.57)
  Bottom Layer w0.381: v2(26.8,92.51) 26.8,93.84 FPC1.9 FPC1.10
  Bottom Layer w0.635: v2(20.25,71.68) 28.45,71.68 v4(29.46,70.66)
  vias: v2(13.02,78.24) v2(16.19,74.57) v2(16.24,70.79) v2(16.19,67.68) v2(20.1,41.71) v2(20.24,68.96) v2(20.27,88.78) v2(20.27,85.36) v2(20.27,81.81) v2(20.27,78.52) v2(20.27,75.1) v2(25.97,49.96) v2(26.1,41.58) v2(26.07,39.17) v2(26.07,36.75) v2(27.3,88.85) v2(29.4,59.36) v2(33.41,71.68) v2(37.65,57.93) v2(41.79,43.09) v2(43.75,46.41) v2(45.12,50.22) v2(45.12,43.1) v2(45.25,57.33) v4(20.46,44.5) v4(20.58,43.1)
PWR_EN: length 38.7
  Top Layer w0.254: v2(31.88,78.03) 31.88,90.09 30.71,91.26 D4.2 ; v2(31.88,73.46) v4(31.88,62.15) ; v4(31.9,59.44) 31.88,59.41 U1.31
  Bottom Layer w0.254: v2(31.88,78.03) v2(31.88,73.46) ; v4(31.88,62.15) 31.88,59.46 v4(31.9,59.44)
RCC_OSC_IN: length 6.2
  Top Layer w0.254: U1.5 31.38,46.54 C2.2 30.47,43.58 X1.1
RCC_OSC_OUT: length 6.2
  Top Layer w0.254: U1.6 31.88,46.59 C3.2 32.83,43.53 X1.2
RST: length 29.1
  Top Layer w0.254: SW1.2 51.54,43.1 R1.1 ; R1.1 46.67,43.1 C1.2 ; R1.1 46.67,47.49 46.1,48.06 32.89,48.06 32.38,48.56 U1.7
SDIO_CK: length 43.2
  Top Layer w0.254: v4(33.99,58.47) 33.74,58.22 33.74,58.22 33.43,57.91 33.43,56.25 U1.28 ; v2(11.25,77.14) 11.76,76.62 13.19,76.62 13.69,76.12 17.02,76.12 17.73,75.41 17.73,73.76 18.41,73.09 26.29,73.09 27.43,71.94 27.43,62.38 28.27,61.54 v4(34.04,61.54)
  Bottom Layer w0.254: CARD1.5 v2(11.25,77.14) ; v4(34.04,61.54) 33.99,61.5 v4(33.99,58.47)
SDIO_CMD: length 66
  Top Layer w0.254: v4(38.61,51.54) 38.58,51.51 U1.16
  Bottom Layer w0.254: 18.68,82.61 19.56,83.49 38.23,83.49 38.61,83.11 v4(38.61,51.54) ; 18.68,82.61 R18.2 ; 18.68,82.61 18.68,82.97 17.91,83.74 14.99,83.74 14.48,83.24 14.48,79.81 14.04,79.37 13.06,79.37 CARD1.3
SDIO_D0: length 58.1
  Top Layer w0.254: v1(12.58,54.39) 24.4,54.39 26.28,52.51 U1.43
  Bottom Layer w0.254: v1(12.58,54.39) 11.95,54.39 9.78,56.57 9.78,73.84 10.88,74.94 CARD1.7 13.27,74.94 13.95,75.62 13.95,76.45 13.9,76.51 13.9,76.67 13.95,76.72 13.95,77.55 13.9,77.61 13.9,77.77 13.95,77.82 13.95,77.88 14.99,78.92 14.99,82.73 15.37,83.11 17.4,83.11 17.78,82.73 17.78,81.08 18.72,80.14 R14.2
SDIO_D1: length 52.9
  Top Layer w0.254: v4(33.06,58.3) 32.89,58.13 32.89,56.22 U1.29
  Bottom Layer w0.254: 14.29,73.9 16.7,73.9 17.91,72.69 28.45,72.69 33.06,68.08 v4(33.06,58.3) ; 14.29,73.9 13.09,73.9 CARD1.8 ; 14.29,73.9 14.48,74.09 14.48,77.27 15.47,78.26 15.47,82.18 15.72,82.43 17.1,82.43 17.27,82.27 17.27,78.03 18.72,76.58 R15.2
SDIO_D2: length 64.2
  Top Layer w0.254: U1.30 32.41,56.23 32.41,58.8 v4(32.46,58.85) ; v4(10.62,72.69) v4(10.62,81.03)
  Bottom Layer w0.254: v4(10.62,72.69) 10.62,57.89 11.81,56.69 23.88,56.69 26.03,58.85 27.73,58.85 27.81,58.78 29.64,58.78 29.72,58.85 v4(32.46,58.85) ; v4(10.62,81.03) 10.57,81.08 10.54,81.08 11,81.54 CARD1.1 13.02,84.07 13.34,84.38 13.34,88.06 13.97,88.7 R16.2
SDIO_D3: length 58.5
  Top Layer w0.254: v4(9.08,58.15) 9.14,58.09 22.48,58.09 27.08,53.49 28.67,53.49 U1.41
  Bottom Layer w0.254: v4(9.08,58.15) 9.02,58.09 8.51,58.09 8,58.6 8,79.17 9.27,80.44 CARD1.2 13.71,80.44 13.97,80.69 13.97,83.74 14.6,84.38 16.38,84.38 17.36,85.36 R17.2
SPI1_CS: length 65
  Top Layer w0.254: v4(41.53,50.47) 35.62,50.47 U1.14
  Bottom Layer w0.254: FPC1.5 24.75,86.43 25.65,85.52 40.39,85.52 41.53,84.38 v4(41.53,50.47)
SPI1_DC: length 64.3
  Top Layer w0.254: U1.13 40.7,50 v4(40.77,49.94)
  Bottom Layer w0.254: FPC1.4 24.25,86.04 25.27,85.01 39.5,85.01 40.77,83.74 v4(40.77,49.94)
SPI1_MISO: length 82.6
  Top Layer w0.254: U1.40 27.65,54.01 v4(27.63,54.03) ; 39.37,46.53 v4(36.17,46.53)
  Bottom Layer w0.254: v4(39.37,46.51) 41.68,46.51 43.03,47.86 43.03,84.91 41.28,86.67 26.54,86.67 25.75,87.46 FPC1.7 ; v4(27.63,54.03) 29.78,54.03 36.17,47.64 v4(36.17,46.53)
SPI1_MOSI: length 64.4
  Top Layer w0.254: v4(42.37,51.97) 42.25,52.09 35.66,52.09 U1.17
  Bottom Layer w0.254: FPC1.6 25.27,93.86 25.27,93.28 25.28,93.27 25.28,86.91 26.16,86.03 40.77,86.03 42.29,84.51 42.29,52.05 v4(42.37,51.97)
SPI1_RST: length 64.3
  Top Layer w0.254: U1.12 34.99,49.2 v4(39.39,49.2)
  Bottom Layer w0.254: FPC1.2 23.25,85 24.26,84 38.61,84 39.37,83.24 39.37,49.22 v4(39.39,49.2)
SPI1_SCK: length 62.3
  Top Layer w0.254: v4(39.96,51.11) 39.86,51.01 U1.15
  Bottom Layer w0.254: FPC1.3 23.75,85.52 24.76,84.51 38.99,84.51 40,83.49 40,51.16 v4(39.96,51.11)
ST25_GPO: length 36
  Top Layer w0.254: 20.1,40.44 v4(22.1,40.44) 22.09,40.45 R24.1 ; v4(34.81,58.73) 34.81,58.36 33.88,57.43 U1.27
  Bottom Layer w0.254: v4(34.81,58.73) 34.81,57.34 33.02,55.55 24.76,55.55 24,54.79 24,42.34 v4(22.1,40.44)
ST25_I2C_SCL: length 31.4
  Top Layer w0.254: v1(36.96,53.53) 36.49,54.01 U1.21 ; U7.6 v1(24.52,39.17)
  Bottom Layer w0.254: v1(36.96,53.53) 36.9,53.47 36.9,41.52 35.69,40.31 25.66,40.31 v1(24.52,39.17)
ST25_I2C_SDA: length 27.5
  Top Layer w0.254: v1(26.92,54.53) 27.38,54.53 27.41,54.56 27.85,54.56 27.87,54.53 28.19,54.53 28.22,54.51 U1.39 ; U7.5 24.26,37.9 24.52,37.63 v1(24.52,36.75)
  Bottom Layer w0.254: v1(26.92,54.53) 25.78,54.53 25.21,53.96 25.21,41.77 23.5,40.06 23.5,37.78 v1(24.52,36.75)
SYS_JTMS-SWCLK: length 25.7
  Top Layer w0.254: H2.2 22.1,59.49 26.08,55.51 U1.37
SYS_JTMS-SWDIO: length 28.7
  Top Layer w0.254: U1.34 30.38,57.17 29.72,57.84 24.89,57.84 20.7,62.03 H2.3
USB_OTG_FS_DM: length 30.9
  Top Layer w0.254: USB1.A7 47.67,69.52 48.49,69.52 48.78,69.23 48.78,68.77 48.53,68.52 USB1.B7 47.65,68.5 44.58,68.5 44.32,68.25 44.32,60.63 43.94,60.25 31.88,60.25 31.3,59.67 31.3,56.29 U1.32
USB_OTG_FS_DP: length 31
  Top Layer w0.254: 45.85,69.02 USB1.A6 ; 45.85,69.02 45.72,69.14 45.72,69.76 45.97,70.02 USB1.B6 ; 45.85,69.02 44.45,69.02 43.69,68.25 43.69,61.65 42.8,60.76 31.75,60.76 30.88,59.89 U1.33
VCAP1: length 2.5
  Top Layer w0.254: U1.22 37.94,54.51 38.03,54.41
$1N3013: length 2.4
  Top Layer w0.254: R2.1 46.26,89.32
$1N3017: length 1.9
  Top Layer w0.254: U3.5 46.11,84.5 R3.1
$1N3940: length 15.1
  Top Layer w0.254: R4.2 21.07,95.68 D3.1 24.3,91.31 D4.1 24.35,84.26 Q2.1
$1N4134: length 11.5
  Top Layer w0.254: R5.1 28.79,76.26 U5.2 ; 26.16,76.26 23.18,76.26 23.18,82.04 Q2.3
$1N5541: length 1374.8
  Top Layer w0.32: 14.7,40.44 NOREF#2.1 6.73,40.44 2.03,35.74 2.03,3.46 4.3,1.19 51.18,1.19 52.2,2.21 52.2,34.09 51.05,35.23 3.94,35.23 2.92,34.21 2.92,3.86 4.57,2.21 50.42,2.21 51.37,3.16 51.37,33.27 50.29,34.34 4.83,34.34 3.81,33.33 3.81,4.5 5.21,3.1 49.53,3.1 50.55,4.12 50.55,32.44 49.53,33.45 5.72,33.45 4.7,32.44 4.7,5.31 5.9,4.12 48.77,4.12 49.66,5 49.66,31.55 48.64,32.56 6.48,32.56 5.46,31.55 5.46,6.15 6.59,5.02 47.77,5.02 48.77,6.02 48.77,30.66 47.75,31.67 7.24,31.67 6.35,30.78 6.35,6.91 7.37,5.89 46.99,5.89 47.88,6.78 47.88,29.77 46.86,30.78 8.13,30.78 7.24,29.9 7.24,7.8 8.25,6.78 46.1,6.78 46.99,7.67 46.99,28.88 45.97,29.9 8.89,29.9 8,29.01 8,8.56 8.89,7.67 45.21,7.67 46.1,8.56 46.1,27.99 45.09,29.01 9.65,29.01 8.76,28.12 8.76,9.32 9.65,8.43 44.32,8.43 45.21,9.32 45.21,27.1 44.2,28.12 10.54,28.12 9.65,27.23 9.65,10.08 10.54,9.19 43.43,9.19 44.32,10.08 44.32,26.21 43.31,27.23 v4(10.79,27.23) ; NOREF.1 11.25,39.17 ; 11.25,39.17 10.79,38.71 v2(10.79,36.25) ; 11.25,39.17 U7.3
  Bottom Layer w0.32: v2(10.79,36.25) v4(10.79,27.23)
$1N11724: length 3.5
  Top Layer w0.254: LED2.1 41.74,41.54 R20.2
$1N12366: length 6.9
  Top Layer w0.254: R21.1 50.55,72.07 49.53,71.04 47.69,71.04 USB1.B5
$1N12483: length 7.2
  Top Layer w0.254: R22.1 50.55,66.97 49.53,68 47.68,68 USB1.A5
$1N12902: length 11.5
  Top Layer w0.254: H3.2 16.13,50.78 R12.2
$1N28171: length 6.9
  Top Layer w0.254: U7.1 14.7,43.71 15.88,44.88 C28.1

## Copper pours and planes (outline as drawn; the poured copper is in the pictures)
+5V on POW: 45.66,72.14 46.69,72.14 46.69,66.41 45.66,66.41
GND on GND: 0.26,99.74 53.74,99.74 53.74,0.26 0.26,0.26
BAT_IN on POW: 20.83,54.92 25.65,54.92 25.65,74.09 44.57,74.09 44.54,81.33 36.19,81.33 36.19,75.49 35.93,75.23 21.38,75.23 21.38,64.23 20.83,63.68
MCU_VCC on POW: 28.83,72.28 33.91,72.28 33.91,55.68 28.83,55.68
MCU_VCC on POW: 26.54,94.67 27.43,94.67 27.43,93.05 27.8,92.69 27.8,88.32 20.81,88.32 20.95,68 19.68,66.73 16.89,66.73 16.89,63.61 5.84,63.61 5.84,50.65 34.67,50.33 34.67,55.55 36.95,58.22 47.43,58.22 47.5,42.47 47.75,42.22 40.65,42.22 40.65,47.99 32.77,47.93 32.77,49.8 28.07,49.8 28.07,35.86 27.56,35.36 20.45,35.36 19.18,36.63 19.18,47.8 18.29,48.69 3.17,48.69 2.41,49.45 2.41,66.09 2.67,66.34 14.48,66.34 14.99,66.85 14.99,73.08 11.43,76.63 11.43,79.68 11.56,79.81 19.67,79.81 19.67,92.03 25.43,92.03 26.54,93.14

Small or netless copper shapes (teardrops, artwork), in the pictures only: 238 on Top Layer, 78 on Bottom Layer, 24 on GND

## Text on the board
Top Silkscreen Layer: 33pF/36pF/39pF/43pF
